# EAGLE board Main Board (EAGLE 5.10)
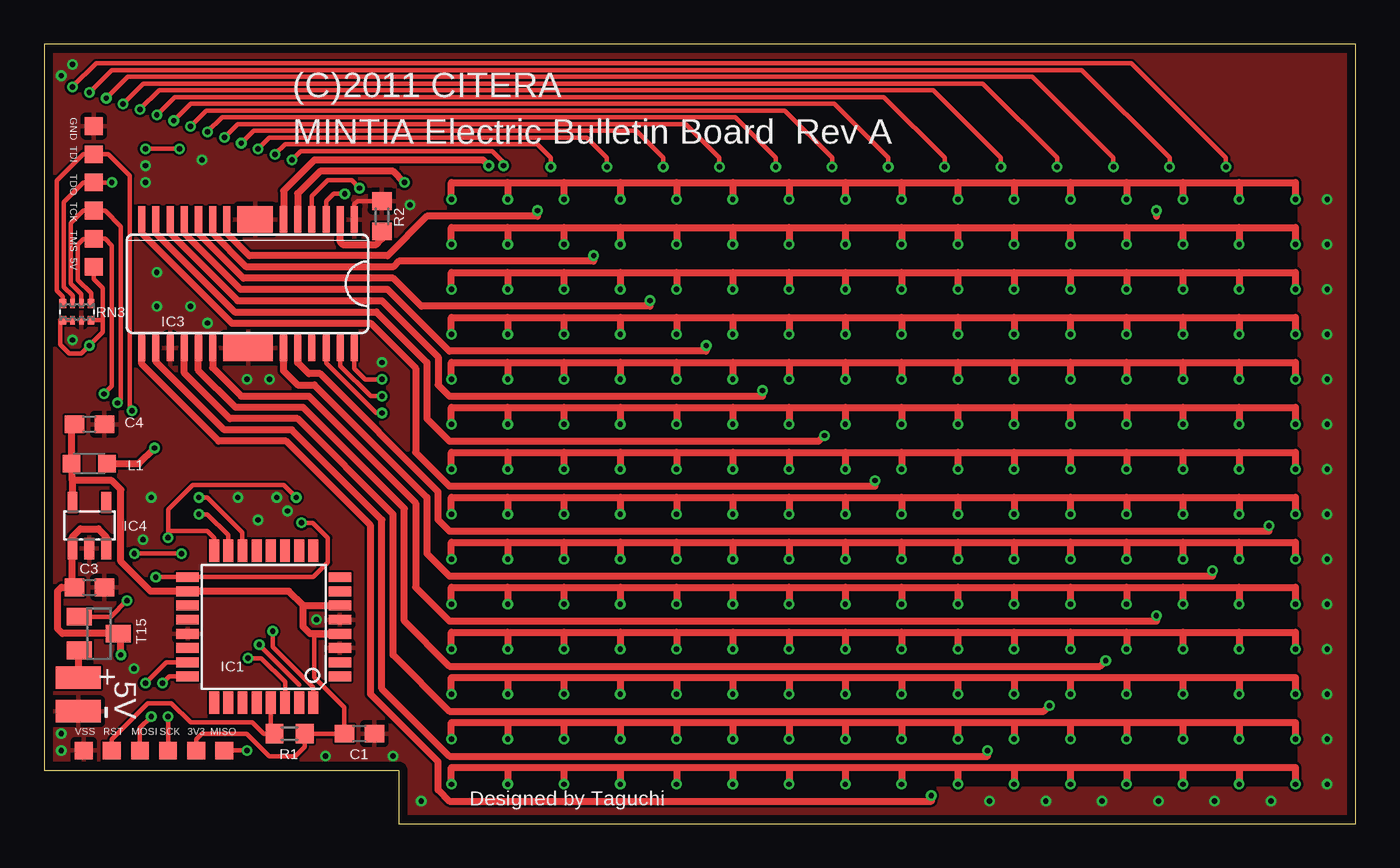
[diagram p1: board, top side]
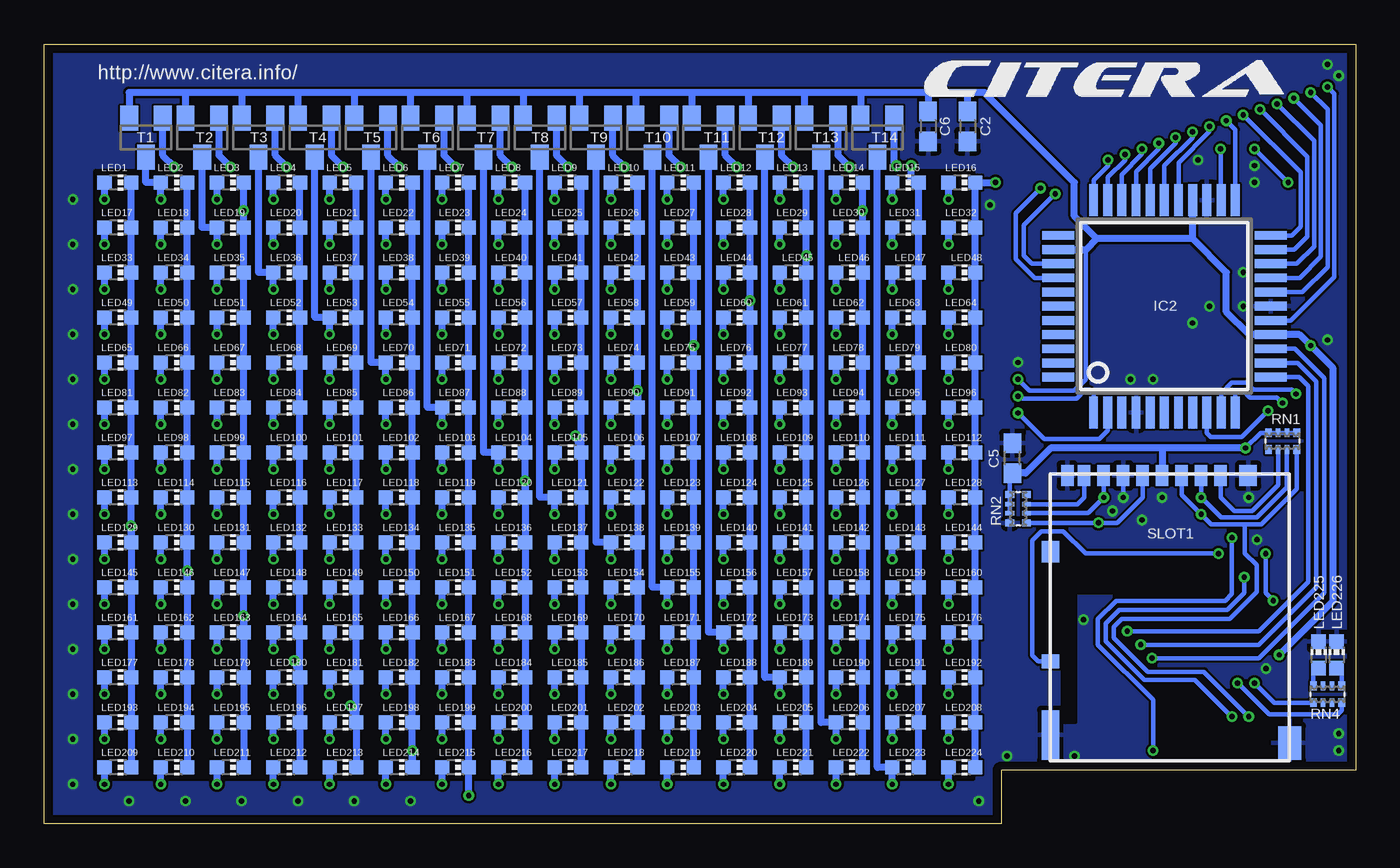
[diagram p2: board, bottom side, seen from below]

Size 74 x 44 mm. Coordinates in mm from the lower left corner, seen from the top.
Outline: 74,44 0,44 0,3 20,3 20,0 74,0 74,44
Copper layers (1+2*15+16): Top 0.018mm / dielectric 0.25mm / Route2 0.035mm / dielectric 1mm / Route15 0.035mm / dielectric 0.25mm / Bottom 0.018mm
Design rules "pban_5mil-l4": minimum track width 5mil, minimum drill 0.3mm, track to track 5mil, track to pad 0.229mm, pad to pad 5mil, via to via 5mil, smd to smd 5mil, copper to edge 0.5mm, drill to drill 0.5mm, minimum pad ring 0.15mm, minimum via ring 0.15mm, stop-mask expansion 4mil, vias tented up to drill 0.35mm, thermal gap 10mil
tRestrict: area 22.9,2.2 to 70.6,36.2
bRestrict: area 21.6,2.5 to 71.1,36.8

## Footprints (pad centres in the part's own frame; a part is rotated, then mirrored left to right if it is on the bottom)
TP10SQ = smd 1 x 1: TP 0,0
SMD1,27-2,54 = smd 1.27 x 2.54: 1 0,0
C0603 = smd 1.1 x 1: 1 -0.85,0; 2 0.85,0
TQFP32-08 = smd 1.27 x 0.559: 1 -4.293,2.8; 2 -4.293,2; 3 -4.293,1.2; 4 -4.293,0.4; 5 -4.293,-0.4; 6 -4.293,-1.2; 7 -4.293,-2; 8 -4.293,-2.8; 17 4.293,-2.8; 18 4.293,-2; 19 4.293,-1.2; 20 4.293,-0.4; 21 4.293,0.4; 22 4.293,1.2; 23 4.293,2; 24 4.293,2.8 | smd 0.559 x 1.27: 9 -2.8,-4.293; 10 -2,-4.293; 11 -1.2,-4.293; 12 -0.4,-4.293; 13 0.4,-4.293; 14 1.2,-4.293; 15 2,-4.293; 16 2.8,-4.293; 25 2.8,4.293; 26 2,4.293; 27 1.2,4.293; 28 0.4,4.293; 29 -0.4,4.293; 30 -1.2,4.293; 31 -2,4.293; 32 -2.8,4.293
SQFP-S-10X10-44 = smd 0.5 x 1.8: 1 -4,-6; 2 -3.2,-6; 3 -2.4,-6; 4 -1.6,-6; 5 -0.8,-6; 6 0,-6; 7 0.8,-6; 8 1.6,-6; 9 2.4,-6; 10 3.2,-6; 11 4,-6; 23 4,6; 24 3.2,6; 25 2.4,6; 26 1.6,6; 27 0.8,6; 28 0,6; 29 -0.8,6; 30 -1.6,6; 31 -2.4,6; 32 -3.2,6; 33 -4,6 | smd 1.8 x 0.5: 12 6,-4; 13 6,-3.2; 14 6,-2.4; 15 6,-1.6; 16 6,-0.8; 17 6,0; 18 6,0.8; 19 6,1.6; 20 6,2.4; 21 6,3.2; 22 6,4; 34 -6,4; 35 -6,3.2; 36 -6,2.4; 37 -6,1.6; 38 -6,0.8; 39 -6,0; 40 -6,-0.8; 41 -6,-1.6; 42 -6,-2.4; 43 -6,-3.2; 44 -6,-4
HSOP25 = smd 0.4 x 1.5: 1 -6.07,-3.625; 2 -5.27,-3.625; 3 -4.47,-3.625; 4 -3.67,-3.625; 5 -2.87,-3.625; 6 -2.07,-3.625; 7 1.13,-3.625; 8 1.93,-3.625; 9 2.73,-3.625; 10 3.53,-3.625; 11 4.33,-3.625; 12 5.13,-3.625; 13 5.93,-3.625; 14 5.93,3.625; 15 5.13,3.625; 16 4.33,3.625; 17 3.53,3.625; 18 2.73,3.625; 19 1.93,3.625; 20 -2.07,3.625; 21 -2.87,3.625; 22 -3.67,3.625; 23 -4.47,3.625; 24 -5.27,3.625; 25 -6.07,3.625 | smd 2 x 1.5: 26 -0.47,-3.625 | smd 2.8 x 1.5: 27 -0.072,3.628
SOT23-5L = smd 0.55 x 1.2: 1 -0.95,-1.3; 2 0,-1.3; 3 0.95,-1.3; 4 0.95,1.3; 5 -0.95,1.3
L2012C = smd 1 x 1: 1 -1,0; 2 1,0
CHIP-LED0603 = smd 0.8 x 0.8: A 0,-0.75; C 0,0.75
R0603 = smd 1 x 1.1: 1 -0.85,0; 2 0.85,0
EXBN8V = smd 0.38 x 0.5: 1 -0.8,-0.475; 4 0.8,-0.475; 5 0.8,0.475; 8 -0.8,0.475 | smd 0.25 x 0.5: 2 -0.25,-0.475; 3 0.25,-0.475; 6 0.25,0.475; 7 -0.25,0.475
DM3AT-SF-PEJ = smd 0.7 x 1.2: 1 0,0.6; 2 -1.1,0.6; 3 -2.2,0.6; 4 -3.3,0.6; 5 -4.4,0.6; 6 -5.5,0.6; 7 -6.6,0.6; 8 -7.7,0.6; 9 -8.65,0.6 | smd 1 x 1.2: 10 -9.6,-3.7; 14 1.55,0.6 | smd 1 x 0.8: 11 -9.6,-9.9 | smd 1 x 2.8: 12 -9.6,-14.05 | smd 1.3 x 1.9: 13 3.9,-14.5
SOT23 = smd 1 x 1.4: 1 -0.95,-1.1; 2 0.95,-1.1; 3 0,1.1

## Placement (x,y rotation side)
3V3  TPTP10SQ  [TP10SQ]  8.57,4.13 180 top
5V  TPTP10SQ  [TP10SQ]  2.79,31.43 180 top
+  [SMD1,27-2,54]  1.91,8.26 90 top
-  [SMD1,27-2,54]  1.91,6.35 90 top
C1  0.1uF  [C0603]  17.78,5.08 0 top
C2  0.1uF  [C0603]  21.91,39.37 270 bottom
C3  1uF  [C0603]  2.54,13.34 0 top
C4  1uF  [C0603]  2.54,22.54 0 top
C5  0.1uF  [C0603]  19.37,20.64 90 bottom
C6  0.1uF  [C0603]  24.13,39.37 270 bottom
GND  TPTP10SQ  [TP10SQ]  2.79,39.37 180 top
IC1  ATMEGA8,88,168,328-TQFP  [TQFP32-08]  12.38,11.11 180 top
IC2  XC9536_44VQ  [SQFP-S-10X10-44]  10.79,29.21 0 bottom
IC3  BD7851FP  [HSOP25]  11.43,30.48 180 top
IC4  PT7M8206B33TA5EX  [SOT23-5L]  2.54,16.83 0 top
L1  330uH  [L2012C]  2.54,20.32 180 top
LED1  RED  [CHIP-LED0603]  69.85,36.2 270 bottom
LED2  RED  [CHIP-LED0603]  66.67,36.2 270 bottom
LED3  RED  [CHIP-LED0603]  63.5,36.2 270 bottom
LED4  RED  [CHIP-LED0603]  60.33,36.2 270 bottom
LED5  RED  [CHIP-LED0603]  57.15,36.2 270 bottom
LED6  RED  [CHIP-LED0603]  53.98,36.2 270 bottom
LED7  RED  [CHIP-LED0603]  50.8,36.2 270 bottom
LED8  RED  [CHIP-LED0603]  47.62,36.2 270 bottom
LED9  RED  [CHIP-LED0603]  44.45,36.2 270 bottom
LED10  RED  [CHIP-LED0603]  41.27,36.2 270 bottom
LED11  RED  [CHIP-LED0603]  38.1,36.2 270 bottom
LED12  RED  [CHIP-LED0603]  34.92,36.2 270 bottom
LED13  RED  [CHIP-LED0603]  31.75,36.2 270 bottom
LED14  RED  [CHIP-LED0603]  28.57,36.2 270 bottom
LED15  RED  [CHIP-LED0603]  25.4,36.2 270 bottom
LED16  RED  [CHIP-LED0603]  22.23,36.2 270 bottom
LED17  RED  [CHIP-LED0603]  69.85,33.66 270 bottom
LED18  RED  [CHIP-LED0603]  66.67,33.66 270 bottom
LED19  RED  [CHIP-LED0603]  63.5,33.66 270 bottom
LED20  RED  [CHIP-LED0603]  60.33,33.66 270 bottom
LED21  RED  [CHIP-LED0603]  57.15,33.66 270 bottom
LED22  RED  [CHIP-LED0603]  53.98,33.66 270 bottom
LED23  RED  [CHIP-LED0603]  50.8,33.66 270 bottom
LED24  RED  [CHIP-LED0603]  47.62,33.66 270 bottom
LED25  RED  [CHIP-LED0603]  44.45,33.66 270 bottom
LED26  RED  [CHIP-LED0603]  41.27,33.66 270 bottom
LED27  RED  [CHIP-LED0603]  38.1,33.66 270 bottom
LED28  RED  [CHIP-LED0603]  34.92,33.66 270 bottom
LED29  RED  [CHIP-LED0603]  31.75,33.66 270 bottom
LED30  RED  [CHIP-LED0603]  28.57,33.66 270 bottom
LED31  RED  [CHIP-LED0603]  25.4,33.66 270 bottom
LED32  RED  [CHIP-LED0603]  22.23,33.66 270 bottom
LED33  RED  [CHIP-LED0603]  69.85,31.11 270 bottom
LED34  RED  [CHIP-LED0603]  66.67,31.11 270 bottom
LED35  RED  [CHIP-LED0603]  63.5,31.11 270 bottom
LED36  RED  [CHIP-LED0603]  60.33,31.11 270 bottom
LED37  RED  [CHIP-LED0603]  57.15,31.11 270 bottom
LED38  RED  [CHIP-LED0603]  53.98,31.11 270 bottom
LED39  RED  [CHIP-LED0603]  50.8,31.11 270 bottom
LED40  RED  [CHIP-LED0603]  47.62,31.11 270 bottom
LED41  RED  [CHIP-LED0603]  44.45,31.11 270 bottom
LED42  RED  [CHIP-LED0603]  41.27,31.11 270 bottom
LED43  RED  [CHIP-LED0603]  38.1,31.11 270 bottom
LED44  RED  [CHIP-LED0603]  34.92,31.11 270 bottom
LED45  RED  [CHIP-LED0603]  31.75,31.11 270 bottom
LED46  RED  [CHIP-LED0603]  28.57,31.11 270 bottom
LED47  RED  [CHIP-LED0603]  25.4,31.11 270 bottom
LED48  RED  [CHIP-LED0603]  22.23,31.11 270 bottom
LED49  RED  [CHIP-LED0603]  69.85,28.57 270 bottom
LED50  RED  [CHIP-LED0603]  66.67,28.57 270 bottom
LED51  RED  [CHIP-LED0603]  63.5,28.57 270 bottom
LED52  RED  [CHIP-LED0603]  60.33,28.57 270 bottom
LED53  RED  [CHIP-LED0603]  57.15,28.57 270 bottom
LED54  RED  [CHIP-LED0603]  53.98,28.57 270 bottom
LED55  RED  [CHIP-LED0603]  50.8,28.57 270 bottom
LED56  RED  [CHIP-LED0603]  47.62,28.57 270 bottom
LED57  RED  [CHIP-LED0603]  44.45,28.57 270 bottom
LED58  RED  [CHIP-LED0603]  41.27,28.57 270 bottom
LED59  RED  [CHIP-LED0603]  38.1,28.57 270 bottom
LED60  RED  [CHIP-LED0603]  34.92,28.57 270 bottom
LED61  RED  [CHIP-LED0603]  31.75,28.57 270 bottom
LED62  RED  [CHIP-LED0603]  28.57,28.57 270 bottom
LED63  RED  [CHIP-LED0603]  25.4,28.57 270 bottom
LED64  RED  [CHIP-LED0603]  22.23,28.57 270 bottom
LED65  RED  [CHIP-LED0603]  69.85,26.04 270 bottom
LED66  RED  [CHIP-LED0603]  66.67,26.04 270 bottom
LED67  RED  [CHIP-LED0603]  63.5,26.04 270 bottom
LED68  RED  [CHIP-LED0603]  60.33,26.04 270 bottom
LED69  RED  [CHIP-LED0603]  57.15,26.04 270 bottom
LED70  RED  [CHIP-LED0603]  53.98,26.04 270 bottom
LED71  RED  [CHIP-LED0603]  50.8,26.04 270 bottom
LED72  RED  [CHIP-LED0603]  47.62,26.04 270 bottom
LED73  RED  [CHIP-LED0603]  44.45,26.04 270 bottom
LED74  RED  [CHIP-LED0603]  41.27,26.04 270 bottom
LED75  RED  [CHIP-LED0603]  38.1,26.04 270 bottom
LED76  RED  [CHIP-LED0603]  34.92,26.04 270 bottom
LED77  RED  [CHIP-LED0603]  31.75,26.04 270 bottom
LED78  RED  [CHIP-LED0603]  28.57,26.04 270 bottom
LED79  RED  [CHIP-LED0603]  25.4,26.04 270 bottom
LED80  RED  [CHIP-LED0603]  22.23,26.04 270 bottom
LED81  RED  [CHIP-LED0603]  69.85,23.5 270 bottom
LED82  RED  [CHIP-LED0603]  66.67,23.5 270 bottom
LED83  RED  [CHIP-LED0603]  63.5,23.5 270 bottom
LED84  RED  [CHIP-LED0603]  60.33,23.5 270 bottom
LED85  RED  [CHIP-LED0603]  57.15,23.5 270 bottom
LED86  RED  [CHIP-LED0603]  53.98,23.5 270 bottom
LED87  RED  [CHIP-LED0603]  50.8,23.5 270 bottom
LED88  RED  [CHIP-LED0603]  47.62,23.5 270 bottom
LED89  RED  [CHIP-LED0603]  44.45,23.5 270 bottom
LED90  RED  [CHIP-LED0603]  41.27,23.5 270 bottom
LED91  RED  [CHIP-LED0603]  38.1,23.5 270 bottom
LED92  RED  [CHIP-LED0603]  34.92,23.5 270 bottom
LED93  RED  [CHIP-LED0603]  31.75,23.5 270 bottom
LED94  RED  [CHIP-LED0603]  28.57,23.5 270 bottom
LED95  RED  [CHIP-LED0603]  25.4,23.5 270 bottom
LED96  RED  [CHIP-LED0603]  22.23,23.5 270 bottom
LED97  RED  [CHIP-LED0603]  69.85,20.95 270 bottom
LED98  RED  [CHIP-LED0603]  66.67,20.95 270 bottom
LED99  RED  [CHIP-LED0603]  63.5,20.95 270 bottom
LED100  RED  [CHIP-LED0603]  60.33,20.95 270 bottom
LED101  RED  [CHIP-LED0603]  57.15,20.95 270 bottom
LED102  RED  [CHIP-LED0603]  53.98,20.95 270 bottom
LED103  RED  [CHIP-LED0603]  50.8,20.95 270 bottom
LED104  RED  [CHIP-LED0603]  47.62,20.95 270 bottom
LED105  RED  [CHIP-LED0603]  44.45,20.95 270 bottom
LED106  RED  [CHIP-LED0603]  41.27,20.95 270 bottom
LED107  RED  [CHIP-LED0603]  38.1,20.95 270 bottom
LED108  RED  [CHIP-LED0603]  34.92,20.95 270 bottom
LED109  RED  [CHIP-LED0603]  31.75,20.95 270 bottom
LED110  RED  [CHIP-LED0603]  28.57,20.95 270 bottom
LED111  RED  [CHIP-LED0603]  25.4,20.95 270 bottom
LED112  RED  [CHIP-LED0603]  22.23,20.95 270 bottom
LED113  RED  [CHIP-LED0603]  69.85,18.41 270 bottom
LED114  RED  [CHIP-LED0603]  66.67,18.41 270 bottom
LED115  RED  [CHIP-LED0603]  63.5,18.41 270 bottom
LED116  RED  [CHIP-LED0603]  60.33,18.41 270 bottom
LED117  RED  [CHIP-LED0603]  57.15,18.41 270 bottom
LED118  RED  [CHIP-LED0603]  53.98,18.41 270 bottom
LED119  RED  [CHIP-LED0603]  50.8,18.41 270 bottom
LED120  RED  [CHIP-LED0603]  47.62,18.41 270 bottom
LED121  RED  [CHIP-LED0603]  44.45,18.41 270 bottom
LED122  RED  [CHIP-LED0603]  41.27,18.41 270 bottom
LED123  RED  [CHIP-LED0603]  38.1,18.41 270 bottom
LED124  RED  [CHIP-LED0603]  34.92,18.41 270 bottom
LED125  RED  [CHIP-LED0603]  31.75,18.41 270 bottom
LED126  RED  [CHIP-LED0603]  28.57,18.41 270 bottom
LED127  RED  [CHIP-LED0603]  25.4,18.41 270 bottom
LED128  RED  [CHIP-LED0603]  22.23,18.41 270 bottom
LED129  RED  [CHIP-LED0603]  69.85,15.88 270 bottom
LED130  RED  [CHIP-LED0603]  66.67,15.88 270 bottom
LED131  RED  [CHIP-LED0603]  63.5,15.88 270 bottom
LED132  RED  [CHIP-LED0603]  60.33,15.88 270 bottom
LED133  RED  [CHIP-LED0603]  57.15,15.88 270 bottom
LED134  RED  [CHIP-LED0603]  53.98,15.88 270 bottom
LED135  RED  [CHIP-LED0603]  50.8,15.88 270 bottom
LED136  RED  [CHIP-LED0603]  47.62,15.88 270 bottom
LED137  RED  [CHIP-LED0603]  44.45,15.88 270 bottom
LED138  RED  [CHIP-LED0603]  41.27,15.88 270 bottom
LED139  RED  [CHIP-LED0603]  38.1,15.88 270 bottom
LED140  RED  [CHIP-LED0603]  34.92,15.88 270 bottom
LED141  RED  [CHIP-LED0603]  31.75,15.88 270 bottom
LED142  RED  [CHIP-LED0603]  28.57,15.88 270 bottom
LED143  RED  [CHIP-LED0603]  25.4,15.88 270 bottom
LED144  RED  [CHIP-LED0603]  22.23,15.88 270 bottom
LED145  RED  [CHIP-LED0603]  69.85,13.34 270 bottom
LED146  RED  [CHIP-LED0603]  66.67,13.34 270 bottom
LED147  RED  [CHIP-LED0603]  63.5,13.34 270 bottom
LED148  RED  [CHIP-LED0603]  60.33,13.34 270 bottom
LED149  RED  [CHIP-LED0603]  57.15,13.34 270 bottom
LED150  RED  [CHIP-LED0603]  53.98,13.34 270 bottom
LED151  RED  [CHIP-LED0603]  50.8,13.34 270 bottom
LED152  RED  [CHIP-LED0603]  47.62,13.34 270 bottom
LED153  RED  [CHIP-LED0603]  44.45,13.34 270 bottom
LED154  RED  [CHIP-LED0603]  41.27,13.34 270 bottom
LED155  RED  [CHIP-LED0603]  38.1,13.34 270 bottom
LED156  RED  [CHIP-LED0603]  34.92,13.34 270 bottom
LED157  RED  [CHIP-LED0603]  31.75,13.34 270 bottom
LED158  RED  [CHIP-LED0603]  28.57,13.34 270 bottom
LED159  RED  [CHIP-LED0603]  25.4,13.34 270 bottom
LED160  RED  [CHIP-LED0603]  22.23,13.34 270 bottom
LED161  RED  [CHIP-LED0603]  69.85,10.79 270 bottom
LED162  RED  [CHIP-LED0603]  66.67,10.79 270 bottom
LED163  RED  [CHIP-LED0603]  63.5,10.79 270 bottom
LED164  RED  [CHIP-LED0603]  60.33,10.79 270 bottom
LED165  RED  [CHIP-LED0603]  57.15,10.79 270 bottom
LED166  RED  [CHIP-LED0603]  53.98,10.79 270 bottom
LED167  RED  [CHIP-LED0603]  50.8,10.79 270 bottom
LED168  RED  [CHIP-LED0603]  47.62,10.79 270 bottom
LED169  RED  [CHIP-LED0603]  44.45,10.79 270 bottom
LED170  RED  [CHIP-LED0603]  41.27,10.79 270 bottom
LED171  RED  [CHIP-LED0603]  38.1,10.79 270 bottom
LED172  RED  [CHIP-LED0603]  34.92,10.79 270 bottom
LED173  RED  [CHIP-LED0603]  31.75,10.79 270 bottom
LED174  RED  [CHIP-LED0603]  28.57,10.79 270 bottom
LED175  RED  [CHIP-LED0603]  25.4,10.79 270 bottom
LED176  RED  [CHIP-LED0603]  22.23,10.79 270 bottom
LED177  RED  [CHIP-LED0603]  69.85,8.26 270 bottom
LED178  RED  [CHIP-LED0603]  66.67,8.26 270 bottom
LED179  RED  [CHIP-LED0603]  63.5,8.26 270 bottom
LED180  RED  [CHIP-LED0603]  60.33,8.26 270 bottom
LED181  RED  [CHIP-LED0603]  57.15,8.26 270 bottom
LED182  RED  [CHIP-LED0603]  53.98,8.26 270 bottom
LED183  RED  [CHIP-LED0603]  50.8,8.26 270 bottom
LED184  RED  [CHIP-LED0603]  47.62,8.26 270 bottom
LED185  RED  [CHIP-LED0603]  44.45,8.26 270 bottom
LED186  RED  [CHIP-LED0603]  41.27,8.26 270 bottom
LED187  RED  [CHIP-LED0603]  38.1,8.26 270 bottom
LED188  RED  [CHIP-LED0603]  34.92,8.26 270 bottom
LED189  RED  [CHIP-LED0603]  31.75,8.26 270 bottom
LED190  RED  [CHIP-LED0603]  28.57,8.26 270 bottom
LED191  RED  [CHIP-LED0603]  25.4,8.26 270 bottom
LED192  RED  [CHIP-LED0603]  22.23,8.26 270 bottom
LED193  RED  [CHIP-LED0603]  69.85,5.71 270 bottom
LED194  RED  [CHIP-LED0603]  66.67,5.71 270 bottom
LED195  RED  [CHIP-LED0603]  63.5,5.71 270 bottom
LED196  RED  [CHIP-LED0603]  60.33,5.71 270 bottom
LED197  RED  [CHIP-LED0603]  57.15,5.71 270 bottom
LED198  RED  [CHIP-LED0603]  53.98,5.71 270 bottom
LED199  RED  [CHIP-LED0603]  50.8,5.71 270 bottom
LED200  RED  [CHIP-LED0603]  47.62,5.71 270 bottom
LED201  RED  [CHIP-LED0603]  44.45,5.71 270 bottom
LED202  RED  [CHIP-LED0603]  41.27,5.71 270 bottom
LED203  RED  [CHIP-LED0603]  38.1,5.71 270 bottom
LED204  RED  [CHIP-LED0603]  34.92,5.71 270 bottom
LED205  RED  [CHIP-LED0603]  31.75,5.71 270 bottom
LED206  RED  [CHIP-LED0603]  28.57,5.71 270 bottom
LED207  RED  [CHIP-LED0603]  25.4,5.71 270 bottom
LED208  RED  [CHIP-LED0603]  22.23,5.71 270 bottom
LED209  RED  [CHIP-LED0603]  69.85,3.17 270 bottom
LED210  RED  [CHIP-LED0603]  66.67,3.17 270 bottom
LED211  RED  [CHIP-LED0603]  63.5,3.17 270 bottom
LED212  RED  [CHIP-LED0603]  60.33,3.17 270 bottom
LED213  RED  [CHIP-LED0603]  57.15,3.17 270 bottom
LED214  RED  [CHIP-LED0603]  53.98,3.17 270 bottom
LED215  RED  [CHIP-LED0603]  50.8,3.17 270 bottom
LED216  RED  [CHIP-LED0603]  47.62,3.17 270 bottom
LED217  RED  [CHIP-LED0603]  44.45,3.17 270 bottom
LED218  RED  [CHIP-LED0603]  41.27,3.17 270 bottom
LED219  RED  [CHIP-LED0603]  38.1,3.17 270 bottom
LED220  RED  [CHIP-LED0603]  34.92,3.17 270 bottom
LED221  RED  [CHIP-LED0603]  31.75,3.17 270 bottom
LED222  RED  [CHIP-LED0603]  28.57,3.17 270 bottom
LED223  RED  [CHIP-LED0603]  25.4,3.17 270 bottom
LED224  RED  [CHIP-LED0603]  22.23,3.17 270 bottom
LED225  RED  [CHIP-LED0603]  2.1,9.53 0 bottom
LED226  GREEN  [CHIP-LED0603]  1.08,9.53 0 bottom
MISO  TPTP10SQ  [TP10SQ]  10.16,4.13 180 top
MOSI  TPTP10SQ  [TP10SQ]  5.4,4.13 180 top
R1  10k  [R0603]  13.84,5.08 180 top
R2  2k  [R0603]  19.05,34.29 270 top
RN1  47k  [EXBN8V]  4.13,21.59 0 bottom
RN2  47k  [EXBN8V]  19.05,17.78 90 bottom
RN3  10k  [EXBN8V]  1.84,28.89 180 top
RN4  1k  [EXBN8V]  1.59,7.3 180 bottom
RST  TPTP10SQ  [TP10SQ]  3.81,4.13 180 top
SCK  TPTP10SQ  [TP10SQ]  6.99,4.13 180 top
SLOT1  DM3AT-SF-PEJ  [DM3AT-SF-PEJ]  7.62,19.05 0 bottom
T1  IRLML6402  [SOT23]  68.26,38.73 180 bottom
T2  IRLML6402  [SOT23]  65.09,38.73 180 bottom
T3  IRLML6402  [SOT23]  61.91,38.73 180 bottom
T4  IRLML6402  [SOT23]  58.74,38.73 180 bottom
T5  IRLML6402  [SOT23]  55.56,38.73 180 bottom
T6  IRLML6402  [SOT23]  52.39,38.73 180 bottom
T7  IRLML6402  [SOT23]  49.21,38.73 180 bottom
T8  IRLML6402  [SOT23]  46.04,38.73 180 bottom
T9  IRLML6402  [SOT23]  42.86,38.73 180 bottom
T10  IRLML6402  [SOT23]  39.69,38.73 180 bottom
T11  IRLML6402  [SOT23]  36.51,38.73 180 bottom
T12  IRLML6402  [SOT23]  33.34,38.73 180 bottom
T13  IRLML6402  [SOT23]  30.16,38.73 180 bottom
T14  IRLML6402  [SOT23]  26.99,38.73 180 bottom
T15  IRLML6402  [SOT23]  3.08,10.73 270 top
TCK  TPTP10SQ  [TP10SQ]  2.79,34.61 180 top
TDI  TPTP10SQ  [TP10SQ]  2.79,37.78 180 top
TDO  TPTP10SQ  [TP10SQ]  2.79,36.2 180 top
TMS  TPTP10SQ  [TP10SQ]  2.79,33.02 180 top
U$1  [CITERA]  24.75,40.75 0 bottom
VSS  TPTP10SQ  [TP10SQ]  2.22,4.13 180 top

## Tracks (layer width: path | path; a pad name or v marks a point on that pad's centre or on a via)
+3V3
  Top 0.254: 3V3.TP 8.57,4.76 8.89,5.08 11.43,5.08 12.7,3.81 14.16,3.81 14.69,4.34 R1.1 C1.1 16.93,6.57 15.24,8.26 15.24,10.71
  Top 0.406: 1.59,19.37 IC4.5 | 14.61,12.31 14.61,11.11 15.01,10.71 IC1.4 15.24,10.71 | 14.61,12.31 IC1.6 | 14.61,12.31 13.8,13.11 IC1.18 6,13.11 4.32,14.79 4.32,18.86 3.81,19.37 1.59,19.37 | 1.59,19.37 1.59,20.32 L1.2 1.54,22.54 C4.1
+5V  (via drill 0.3)
  Top 0.254: IC3.25 17.5,25.68 18.1,25.08 v19.05,25.08 | 3.3,28.42 3.3,27.75 v2.54,26.99 2.1,26.54 1.4,26.54 0.89,27.05 0.89,28.42 RN3.5 RN3.6 | 5V.TP 2.79,30.73 3.3,30.23 3.3,28.42 | 3.3,28.42 RN3.8
  Top 0.406: IC4.3 3.49,16.2 3.05,16.64 2.03,16.64 1.59,16.2 IC4.1 1.59,13.34 | v4.32,9.53 4.32,10.73 T15.3 1.02,10.73 0.75,11 0.75,13.12 0.96,13.34 1.59,13.34 | 1.59,13.34 C3.1
  Bottom 0.254: v19.05,25.08 18.41,24.45 15.88,24.45 15.24,25.08 15.24,32.38
  Bottom 0.406: T1.2 69.21,41.27 66.04,41.27 | 66.04,41.27 T2.2 | 62.86,41.27 66.04,41.27 | 50.16,41.27 53.34,41.27 | 43.81,41.27 46.99,41.27 | 37.46,41.27 40.64,41.27 | 31.11,41.27 34.29,41.27 | 27.94,41.27 T14.2 | 31.11,41.27 T13.2 | 27.94,41.27 31.11,41.27 | 34.29,41.27 T12.2 | 37.46,41.27 T11.2 | 34.29,41.27 37.46,41.27 | 40.64,41.27 T10.2 | 43.81,41.27 T9.2 | 40.64,41.27 43.81,41.27 | 46.99,41.27 T8.2 | 50.16,41.27 T7.2 | 46.99,41.27 50.16,41.27 | 53.34,41.27 T6.2 | 53.34,41.27 56.51,41.27 | 56.51,41.27 T5.2 | 56.51,41.27 59.69,41.27 | 59.69,41.27 T4.2 | 62.86,41.27 T3.2 | 59.69,41.27 62.86,41.27 | 9.2,33.02 IC2.26 | 21.91,41.27 24.13,41.27 | 24.13,41.27 27.94,41.27 | 14.61,33.02 15.88,34.29 15.88,36.2 20.95,41.27 21.91,41.27 | 9.2,33.02 7.3,31.11 7.3,28.89 6.02,27.61 IC2.15 3.16,27.61 v2.54,26.99 1.27,25.72 1.27,12.57 v4.32,9.53 | 9.2,33.02 14.61,33.02 | 14.61,33.02 15.24,32.38 16.77,32.38 IC2.35 | 24.13,41.27 C6.1 | 21.91,41.27 C2.1
COL_CLK  (via drill 0.3)
  Top 0.254: IC3.23 15.9,26.01 18.73,23.18 v19.05,23.18
  Bottom 0.254: IC2.2 13.99,22.2 14.48,21.71 17.59,21.71 v19.05,23.18
COL_EN  (via drill 0.3)
  Top 0.254: IC3.24 16.7,25.84 18.41,24.13 v19.05,24.13
  Bottom 0.254: IC2.1 14.79,24.3 15,24.5 15.25,24.5 15.75,24 18.92,24 v19.05,24.13
COL_LATCH  (via drill 0.3)
  Top 0.254: IC3.3 15.9,35.14 16.32,35.56 v16.95,35.56
  Bottom 0.254: IC2.36 18.27,31.61 18.73,32.07 18.73,33.78 v16.95,35.56
COL_SDATA  (via drill 0.3)
  Top 0.254: IC3.4 15.1,35.42 16,36.32 17.34,36.32 v17.78,35.88
  Bottom 0.254: IC2.37 18.11,30.81 19.18,31.88 19.18,34.48 v17.78,35.88
CTRL_BUS2  (via drill 0.3)
  Top 0.254: v12.13,10.1 14.38,7.84
  Bottom 0.254: IC2.13 3.28,26.01 2.22,24.96 2.22,13.34 5.46,10.1 v12.13,10.1
CTRL_MOSI  (via drill 0.3)
  Top 0.254: IC1.30 13.58,8.01 12.26,9.34 v11.49,9.34
  Bottom 0.254: IC2.14 3.44,26.81 1.78,25.15 1.78,13.02 5.46,9.34 v11.49,9.34
CTRL_SS  (via drill 0.3)
  Top 0.254: IC1.32 15.18,7.68 12.89,9.97 v12.89,10.86
  Bottom 0.254: IC2.12 3.17,25.21 2.67,24.7 2.67,13.65 5.46,10.86 v12.89,10.86
GND  (via drill 0.3)
  Top 0.254: R2.1 17.68,35.14 17.5,34.96 IC3.1
  Bottom 0.254: SLOT1.6 v13.12,18.41
  other vias: 20.64,34.92 11.43,25.08 12.7,25.08 8.89,37.47 21.27,1.27 19.05,26.04 6.03,18.41 15.37,11.51 10.92,18.41 6.35,31.11 6.35,29.21 8.26,29.21 9.21,28.26 5.71,37.15 12.06,17.14 1.59,42.86 72.39,35.24 72.39,32.7 72.39,30.16 72.39,27.62 72.39,25.08 72.39,22.54 72.39,20 72.39,17.46 72.39,14.92 72.39,12.38 72.39,9.84 72.39,7.3 72.39,4.76 72.39,2.22 5.71,36.2 0.95,42.23 1.59,27.3 15.88,3.81 19.68,3.81 53.34,1.27 56.52,1.27 59.69,1.27 62.87,1.27 66.04,1.27 69.22,1.27 0.95,4.13 0.95,5.08 5.07,8.74 13.72,17.65 5.57,16.02
  pour Top (isolate 0.13): 0.5,43.5 73.5,43.5 73.5,0.5 20.5,0.5 20.5,3.5 0.5,3.5
  pour Bottom (isolate 0.13): 0.5,43.5 0.5,3.5 20.5,3.5 20.5,0.5 73.5,0.5 73.5,43.5
N$1  (via drill 0.3)
  Top 0.406: LED127.A LED128.A v22.98,17.46 | LED127.A LED126.A | LED127.A v26.15,17.46 | v70.6,17.46 LED113.A LED114.A | LED114.A v67.42,17.46 | LED115.A LED114.A | LED115.A v64.25,17.46 | LED116.A LED115.A | LED116.A v61.08,17.46 | LED117.A LED116.A | LED117.A v57.9,17.46 | LED118.A LED117.A | LED118.A v54.73,17.46 | LED119.A LED118.A | LED119.A v51.55,17.46 | LED120.A LED119.A | LED120.A v48.38,17.46 | LED121.A LED120.A | LED121.A v45.2,17.46 | LED122.A LED121.A | LED122.A v42.02,17.46 | LED123.A LED122.A | LED123.A v38.85,17.46 | LED124.A LED123.A | LED124.A v35.67,17.46 | LED125.A LED124.A | LED125.A v32.5,17.46 | LED126.A LED125.A | LED126.A v29.32,17.46
  Bottom 0.406: v67.42,17.46 LED114.A | v64.25,17.46 LED115.A | v61.08,17.46 LED116.A | v57.9,17.46 LED117.A | v54.73,17.46 LED118.A | v51.55,17.46 LED119.A | v48.38,17.46 LED120.A | v45.2,17.46 LED121.A 46.04,18.41 T8.3 | v42.02,17.46 LED122.A | v38.85,17.46 LED123.A | v35.67,17.46 LED124.A | v32.5,17.46 LED125.A | v29.32,17.46 LED126.A | v26.15,17.46 LED127.A | v22.98,17.46 LED128.A | v70.6,17.46 LED113.A
N$2  (via drill 0.3)
  Top 0.406: v50.05,1.59 50.05,1.27 22.86,1.27 22.23,1.91 22.23,3.49 18.41,7.3 18.41,16.83 13.65,21.59 9.84,21.59 5.5,25.93 IC3.14
  Bottom 0.406: LED7.C LED23.C LED39.C LED55.C LED71.C LED87.C LED103.C LED119.C LED135.C LED151.C LED167.C LED183.C LED199.C LED215.C v50.05,1.59
N$3  (via drill 0.3)
  Top 0.406: v46.88,19.37 46.88,19.05 22.86,19.05 20.95,20.95 20.95,25.72 18.41,28.26 10.58,28.26 5.5,33.34 IC3.13
  Bottom 0.406: LED216.C LED200.C LED184.C LED168.C LED152.C LED136.C LED120.C | LED120.C LED104.C LED88.C LED72.C LED56.C LED40.C LED24.C LED8.C | v46.88,19.37 LED120.C
N$4  (via drill 0.3)
  Top 0.406: v44.02,21.91 43.7,21.59 22.86,21.59 21.59,22.86 21.59,26.04 18.73,28.89 10.74,28.89 6.3,33.34 IC3.12
  Bottom 0.406: LED105.C LED121.C LED137.C LED153.C LED169.C LED185.C LED201.C LED217.C 43.7,4.13 | LED105.C LED89.C LED73.C LED57.C LED41.C LED25.C LED9.C | v44.02,21.91 LED105.C
N$5  (via drill 0.3)
  Top 0.406: v70.6,32.7 LED17.A LED18.A | LED18.A v67.42,32.7 | LED19.A LED18.A | LED19.A v64.25,32.7 | LED20.A LED19.A | LED20.A v61.08,32.7 | LED21.A LED20.A | LED21.A v57.9,32.7 | LED22.A LED21.A | LED22.A v54.73,32.7 | LED23.A LED22.A | LED23.A v51.55,32.7 | LED24.A LED23.A | LED24.A v48.38,32.7 | LED25.A LED24.A | LED25.A v45.2,32.7 | LED26.A LED25.A | LED26.A v42.02,32.7 | LED27.A LED26.A | LED27.A v38.85,32.7 | LED28.A LED27.A | LED28.A v35.67,32.7 | LED29.A LED28.A | LED29.A v32.5,32.7 | LED30.A LED29.A | LED30.A v29.32,32.7 | LED31.A LED30.A | LED31.A v26.15,32.7 | LED31.A LED32.A v22.98,32.7
  Bottom 0.406: v70.6,32.7 LED17.A | v67.42,32.7 LED18.A | v64.25,32.7 LED19.A 65.09,33.66 T2.3 | v61.08,32.7 LED20.A | v57.9,32.7 LED21.A | v54.73,32.7 LED22.A | v51.55,32.7 LED23.A | v48.38,32.7 LED24.A | v45.2,32.7 LED25.A | v42.02,32.7 LED26.A | v38.85,32.7 LED27.A | v35.67,32.7 LED28.A | v32.5,32.7 LED29.A | v29.32,32.7 LED30.A | v26.15,32.7 LED31.A | v22.98,32.7 LED32.A
N$6  (via drill 0.3)
  Top 0.406: LED47.A LED48.A v22.98,30.16 | LED47.A LED46.A | LED47.A v26.15,30.16 | v70.6,30.16 LED33.A LED34.A | LED34.A v67.42,30.16 | LED35.A LED34.A | LED35.A v64.25,30.16 | LED36.A LED35.A | LED36.A v61.08,30.16 | LED37.A LED36.A | LED37.A v57.9,30.16 | LED38.A LED37.A | LED38.A v54.73,30.16 | LED39.A LED38.A | LED39.A v51.55,30.16 | LED40.A LED39.A | LED40.A v48.38,30.16 | LED41.A LED40.A | LED41.A v45.2,30.16 | LED42.A LED41.A | LED42.A v42.02,30.16 | LED43.A LED42.A | LED43.A v38.85,30.16 | LED44.A LED43.A | LED44.A v35.67,30.16 | LED45.A LED44.A | LED45.A v32.5,30.16 | LED46.A LED45.A | LED46.A v29.32,30.16
  Bottom 0.406: v70.6,30.16 LED33.A | v67.42,30.16 LED34.A | v64.25,30.16 LED35.A | v61.08,30.16 LED36.A 61.91,31.11 T3.3 | v57.9,30.16 LED37.A | v54.73,30.16 LED38.A | v51.55,30.16 LED39.A | v48.38,30.16 LED40.A | v45.2,30.16 LED41.A | v42.02,30.16 LED42.A | v38.85,30.16 LED43.A | v35.67,30.16 LED44.A | v32.5,30.16 LED45.A | v29.32,30.16 LED46.A | v26.15,30.16 LED47.A | v22.98,30.16 LED48.A
N$7  (via drill 0.3)
  Top 0.406: v70.6,27.62 LED49.A LED50.A | LED50.A v67.42,27.62 | LED51.A LED50.A | LED51.A v64.25,27.62 | LED52.A LED51.A | LED52.A v61.08,27.62 | LED53.A LED52.A | LED53.A v57.9,27.62 | LED54.A LED53.A | LED54.A v54.73,27.62 | LED55.A LED54.A | LED55.A v51.55,27.62 | LED56.A LED55.A | LED56.A v48.38,27.62 | LED57.A LED56.A | LED57.A v45.2,27.62 | LED58.A LED57.A | LED58.A v42.02,27.62 | LED59.A LED58.A | LED59.A v38.85,27.62 | LED60.A LED59.A | LED60.A v35.67,27.62 | LED61.A LED60.A | LED61.A v32.5,27.62 | LED62.A LED61.A | LED62.A v29.32,27.62 | LED63.A LED62.A | LED63.A v26.15,27.62 | LED63.A LED64.A v22.98,27.62
  Bottom 0.406: v70.6,27.62 LED49.A | v67.42,27.62 LED50.A | v64.25,27.62 LED51.A | v61.08,27.62 LED52.A | v57.9,27.62 LED53.A 58.74,28.57 T4.3 | v54.73,27.62 LED54.A | v51.55,27.62 LED55.A | v48.38,27.62 LED56.A | v45.2,27.62 LED57.A | v42.02,27.62 LED58.A | v38.85,27.62 LED59.A | v35.67,27.62 LED60.A | v32.5,27.62 LED61.A | v29.32,27.62 LED62.A | v26.15,27.62 LED63.A | v22.98,27.62 LED64.A
N$8  (via drill 0.3)
  Top 0.406: v70.6,25.08 LED65.A LED66.A | LED66.A v67.42,25.08 | LED67.A LED66.A | LED67.A v64.25,25.08 | LED68.A LED67.A | LED68.A v61.08,25.08 | LED69.A LED68.A | LED69.A v57.9,25.08 | LED70.A LED69.A | LED70.A v54.73,25.08 | LED71.A LED70.A | LED71.A v51.55,25.08 | LED72.A LED71.A | LED72.A v48.38,25.08 | LED73.A LED72.A | LED73.A v45.2,25.08 | LED74.A LED73.A | LED74.A v42.02,25.08 | LED75.A LED74.A | LED75.A v38.85,25.08 | LED76.A LED75.A | LED76.A v35.67,25.08 | LED77.A LED76.A | LED77.A v32.5,25.08 | LED78.A LED77.A | LED78.A v29.32,25.08 | LED79.A LED78.A | LED79.A v26.15,25.08 | LED79.A LED80.A v22.98,25.08
  Bottom 0.406: v70.6,25.08 LED65.A | v67.42,25.08 LED66.A | v64.25,25.08 LED67.A | v61.08,25.08 LED68.A | v57.9,25.08 LED69.A | v54.73,25.08 LED70.A 55.56,26.04 T5.3 | v51.55,25.08 LED71.A | v48.38,25.08 LED72.A | v45.2,25.08 LED73.A | v42.02,25.08 LED74.A | v38.85,25.08 LED75.A | v35.67,25.08 LED76.A | v32.5,25.08 LED77.A | v29.32,25.08 LED78.A | v26.15,25.08 LED79.A | v22.98,25.08 LED80.A
N$9  (via drill 0.3)
  Top 0.406: v70.6,22.54 LED81.A LED82.A | LED82.A v67.42,22.54 | LED83.A LED82.A | LED83.A v64.25,22.54 | LED84.A LED83.A | LED84.A v61.08,22.54 | LED85.A LED84.A | LED85.A v57.9,22.54 | LED86.A LED85.A | LED86.A v54.73,22.54 | LED87.A LED86.A | LED87.A v51.55,22.54 | LED88.A LED87.A | LED88.A v48.38,22.54 | LED89.A LED88.A | LED89.A v45.2,22.54 | LED90.A LED89.A | LED90.A v42.02,22.54 | LED91.A LED90.A | LED91.A v38.85,22.54 | LED92.A LED91.A | LED92.A v35.67,22.54 | LED93.A LED92.A | LED93.A v32.5,22.54 | LED94.A LED93.A | LED94.A v29.32,22.54 | LED95.A LED94.A | LED95.A v26.15,22.54 | LED95.A LED96.A v22.98,22.54
  Bottom 0.406: v70.6,22.54 LED81.A | v67.42,22.54 LED82.A | v64.25,22.54 LED83.A | v61.08,22.54 LED84.A | v57.9,22.54 LED85.A | v54.73,22.54 LED86.A | v51.55,22.54 LED87.A 52.39,23.5 T6.3 | v48.38,22.54 LED88.A | v45.2,22.54 LED89.A | v42.02,22.54 LED90.A | v38.85,22.54 LED91.A | v35.67,22.54 LED92.A | v32.5,22.54 LED93.A | v29.32,22.54 LED94.A | v26.15,22.54 LED95.A | v22.98,22.54 LED96.A
N$10  (via drill 0.3)
  Top 0.406: v70.6,7.3 LED177.A LED178.A | LED178.A v67.42,7.3 | LED179.A LED178.A | LED179.A v64.25,7.3 | LED180.A LED179.A | LED180.A v61.08,7.3 | LED181.A LED180.A | LED181.A v57.9,7.3 | LED182.A LED181.A | LED182.A v54.73,7.3 | LED183.A LED182.A | LED183.A v51.55,7.3 | LED184.A LED183.A | LED184.A v48.38,7.3 | LED185.A LED184.A | LED185.A v45.2,7.3 | LED186.A LED185.A | LED186.A v42.02,7.3 | LED187.A LED186.A | LED187.A v38.85,7.3 | LED188.A LED187.A | LED188.A v35.67,7.3 | LED189.A LED188.A | LED189.A v32.5,7.3 | LED190.A LED189.A | LED190.A v29.32,7.3 | LED191.A LED190.A | LED191.A v26.15,7.3 | LED191.A LED192.A v22.98,7.3
  Bottom 0.406: v70.6,7.3 LED177.A | v67.42,7.3 LED178.A | v64.25,7.3 LED179.A | v61.08,7.3 LED180.A | v57.9,7.3 LED181.A | v54.73,7.3 LED182.A | v51.55,7.3 LED183.A | v48.38,7.3 LED184.A | v45.2,7.3 LED185.A | v42.02,7.3 LED186.A | v38.85,7.3 LED187.A | v35.67,7.3 LED188.A | v32.5,7.3 LED189.A 33.34,8.26 T12.3 | v29.32,7.3 LED190.A | v26.15,7.3 LED191.A | v22.98,7.3 LED192.A
N$11  (via drill 0.3)
  Top 0.406: v40.52,24.45 40.52,24.13 22.86,24.13 22.23,24.77 22.23,26.35 19.05,29.53 10.91,29.53 7.1,33.34 IC3.11
  Bottom 0.406: LED202.C LED218.C | LED202.C LED186.C LED170.C LED154.C LED138.C LED122.C LED106.C LED90.C | LED90.C LED74.C LED58.C LED42.C LED26.C LED10.C | LED202.C 40.52,6.67 | v40.52,24.45 LED90.C
N$12  (via drill 0.3)
  Top 0.406: v70.6,14.92 LED129.A LED130.A | LED130.A v67.42,14.92 | LED131.A LED130.A | LED131.A v64.25,14.92 | LED132.A LED131.A | LED132.A v61.08,14.92 | LED133.A LED132.A | LED133.A v57.9,14.92 | LED134.A LED133.A | LED134.A v54.73,14.92 | LED135.A LED134.A | LED135.A v51.55,14.92 | LED136.A LED135.A | LED137.A LED136.A | LED137.A v45.2,14.92 | LED138.A LED137.A | LED138.A v42.02,14.92 | LED139.A LED138.A | LED139.A v38.85,14.92 | LED140.A LED139.A | LED140.A v35.67,14.92 | LED141.A LED140.A | LED141.A v32.5,14.92 | LED142.A LED141.A | LED142.A v29.32,14.92 | LED143.A LED142.A | LED143.A v26.15,14.92 | LED143.A LED144.A v22.98,14.92 | LED136.A v48.38,14.92
  Bottom 0.406: v70.6,14.92 LED129.A | v67.42,14.92 LED130.A | v64.25,14.92 LED131.A | v61.08,14.92 LED132.A | v57.9,14.92 LED133.A | v54.73,14.92 LED134.A | v51.55,14.92 LED135.A | v48.38,14.92 LED136.A | v45.2,14.92 LED137.A | v42.02,14.92 LED138.A 42.86,15.88 T9.3 | v38.85,14.92 LED139.A | v35.67,14.92 LED140.A | v32.5,14.92 LED141.A | v29.32,14.92 LED142.A | v26.15,14.92 LED143.A | v22.98,14.92 LED144.A
N$13  (via drill 0.3)
  Top 0.406: v70.6,12.38 LED145.A LED146.A | LED146.A v67.42,12.38 | LED147.A LED146.A | LED147.A v64.25,12.38 | LED148.A LED147.A | LED148.A v61.08,12.38 | LED149.A LED148.A | LED149.A v57.9,12.38 | LED150.A LED149.A | LED150.A v54.73,12.38 | LED151.A LED150.A | LED151.A v51.55,12.38 | LED152.A LED151.A | LED152.A v48.38,12.38 | LED153.A LED152.A | LED153.A v45.2,12.38 | LED154.A LED153.A | LED154.A v42.02,12.38 | LED155.A LED154.A | LED155.A v38.85,12.38 | LED156.A LED155.A | LED156.A v35.67,12.38 | LED157.A LED156.A | LED157.A v32.5,12.38 | LED158.A LED157.A | LED158.A v29.32,12.38 | LED159.A LED158.A | LED159.A v26.15,12.38 | LED159.A LED160.A v22.98,12.38
  Bottom 0.406: v70.6,12.38 LED145.A | v67.42,12.38 LED146.A | v64.25,12.38 LED147.A | v61.08,12.38 LED148.A | v57.9,12.38 LED149.A | v54.73,12.38 LED150.A | v51.55,12.38 LED151.A | v48.38,12.38 LED152.A | v45.2,12.38 LED153.A | v42.02,12.38 LED154.A | v38.85,12.38 LED155.A 39.69,13.34 T10.3 | v35.67,12.38 LED156.A | v32.5,12.38 LED157.A | v29.32,12.38 LED158.A | v26.15,12.38 LED159.A | v22.98,12.38 LED160.A
N$14  (via drill 0.3)
  Top 0.406: v70.6,9.84 LED161.A LED162.A | LED162.A v67.42,9.84 | LED163.A LED162.A | LED163.A v64.25,9.84 | LED164.A LED163.A | LED164.A v61.08,9.84 | LED165.A LED164.A | LED165.A v57.9,9.84 | LED166.A LED165.A | LED166.A v54.73,9.84 | LED167.A LED166.A | LED167.A v51.55,9.84 | LED168.A LED167.A | LED168.A v48.38,9.84 | LED169.A LED168.A | LED169.A v45.2,9.84 | LED170.A LED169.A | LED170.A v42.02,9.84 | LED171.A LED170.A | LED171.A v38.85,9.84 | LED172.A LED171.A | LED172.A v35.67,9.84 | LED173.A LED172.A | LED173.A v32.5,9.84 | LED174.A LED173.A | LED174.A v29.32,9.84 | LED175.A LED174.A | LED175.A v26.15,9.84 | LED175.A LED176.A v22.98,9.84
  Bottom 0.406: v70.6,9.84 LED161.A | v67.42,9.84 LED162.A | v64.25,9.84 LED163.A | v61.08,9.84 LED164.A | v57.9,9.84 LED165.A | v54.73,9.84 LED166.A | v51.55,9.84 LED167.A | v48.38,9.84 LED168.A | v45.2,9.84 LED169.A | v42.02,9.84 LED170.A | v38.85,9.84 LED171.A | v35.67,9.84 LED172.A 36.51,10.79 T11.3 | v32.5,9.84 LED173.A | v29.32,9.84 LED174.A | v26.15,9.84 LED175.A | v22.98,9.84 LED176.A
N$15  (via drill 0.3)
  Top 0.406: v37.35,26.99 37.35,26.67 22.86,26.67 19.37,30.16 11.07,30.16 7.9,33.34 IC3.10
  Bottom 0.406: LED219.C LED203.C LED187.C | LED187.C LED171.C LED155.C LED139.C LED123.C LED107.C LED91.C LED75.C | LED75.C LED59.C LED43.C LED27.C LED11.C | LED187.C 37.35,9.21 | LED75.C v37.35,26.99
N$16  (via drill 0.3)
  Top 0.406: v70.6,4.76 LED193.A LED194.A | LED194.A v67.42,4.76 | LED195.A LED194.A | LED195.A v64.25,4.76 | LED196.A LED195.A | LED196.A v61.08,4.76 | LED197.A LED196.A | LED197.A v57.9,4.76 | LED198.A LED197.A | LED198.A v54.73,4.76 | LED199.A LED198.A | LED199.A v51.55,4.76 | LED200.A LED199.A | LED200.A v48.38,4.76 | LED201.A LED200.A | LED201.A v45.2,4.76 | LED202.A LED201.A | LED202.A v42.02,4.76 | LED203.A LED202.A | LED203.A v38.85,4.76 | LED204.A LED203.A | LED204.A v35.67,4.76 | LED205.A LED204.A | LED205.A v32.5,4.76 | LED206.A LED205.A | LED206.A v29.32,4.76 | LED207.A LED206.A | LED207.A v26.15,4.76 | LED207.A LED208.A v22.98,4.76
  Bottom 0.406: v70.6,4.76 LED193.A | v67.42,4.76 LED194.A | v64.25,4.76 LED195.A | v61.08,4.76 LED196.A | v57.9,4.76 LED197.A | v54.73,4.76 LED198.A | v51.55,4.76 LED199.A | v45.2,4.76 LED201.A | v48.38,4.76 LED200.A | v42.02,4.76 LED202.A | v38.85,4.76 LED203.A | v35.67,4.76 LED204.A | v32.5,4.76 LED205.A | v29.32,4.76 LED206.A 30.16,5.71 T13.3 | v26.15,4.76 LED207.A | v22.98,4.76 LED208.A
N$17  (via drill 0.3)
  Top 0.406: v70.6,2.22 LED209.A LED210.A | LED210.A v67.42,2.22 | LED211.A LED210.A | LED211.A v64.25,2.22 | LED212.A LED211.A | LED212.A v61.08,2.22 | LED213.A LED212.A | LED213.A v57.9,2.22 | LED214.A LED213.A | LED214.A v54.73,2.22 | LED215.A LED214.A | LED215.A v51.55,2.22 | LED216.A LED215.A | LED216.A v48.38,2.22 | LED217.A LED216.A | LED217.A v45.2,2.22 | LED218.A LED217.A | LED218.A v42.02,2.22 | LED219.A LED218.A | LED219.A v38.85,2.22 | LED220.A LED219.A | LED220.A v35.67,2.22 | LED221.A LED220.A | LED221.A v32.5,2.22 | LED222.A LED221.A | LED222.A v29.32,2.22 | LED223.A LED222.A | LED223.A v26.15,2.22 | LED223.A LED224.A v22.98,2.22
  Bottom 0.406: v70.6,2.22 LED209.A | v67.42,2.22 LED210.A | v64.25,2.22 LED211.A | v61.08,2.22 LED212.A | v57.9,2.22 LED213.A | v54.73,2.22 LED214.A | v48.38,2.22 LED216.A | v51.55,2.22 LED215.A | v45.2,2.22 LED217.A | v42.02,2.22 LED218.A | v38.85,2.22 LED219.A | v35.67,2.22 LED220.A | v32.5,2.22 LED221.A | v29.32,2.22 LED222.A | v26.15,2.22 LED223.A 26.99,3.17 T14.3 | v22.98,2.22 LED224.A
N$18
  Bottom 0.254: LED226.A 0.79,8.78 RN4.1
N$19  (via drill 0.3)
  Top 0.406: v69.1,16.83 69.1,16.51 22.86,16.51 22.23,17.14 22.23,18.73 15.56,25.4 14.92,25.4 14.3,26.02 IC3.21
  Bottom 0.406: LED129.C LED113.C LED97.C LED81.C LED65.C LED49.C LED33.C LED17.C LED1.C | LED129.C LED145.C LED161.C LED177.C LED193.C LED209.C | v69.1,16.83 LED129.C
N$20  (via drill 0.3)
  Top 0.406: v65.92,14.29 65.92,13.97 22.86,13.97 21.59,15.24 21.59,18.41 15.24,24.77 14.29,24.77 13.5,25.55 IC3.20
  Bottom 0.406: LED2.C LED18.C LED34.C LED50.C LED66.C LED82.C LED98.C LED114.C LED130.C LED146.C | LED146.C LED162.C LED178.C LED194.C LED210.C | v65.92,14.29 LED146.C
N$21  (via drill 0.3)
  Top 0.406: v62.75,34.61 62.75,34.29 | v62.75,11.75 62.75,11.43 22.86,11.43 20.95,13.34 20.95,18.1 14.92,24.13 11.11,24.13 9.5,25.74 IC3.19
  Bottom 0.406: LED3.C v62.75,34.61 LED19.C LED35.C LED51.C LED67.C LED83.C LED99.C LED115.C LED131.C LED147.C LED163.C | LED163.C LED179.C LED195.C LED211.C | v62.75,11.75 LED163.C
N$22  (via drill 0.3)
  Top 0.406: v59.89,9.21 59.58,8.89 22.86,8.89 20.32,11.43 20.32,17.78 14.61,23.5 10.79,23.5 8.7,25.59 IC3.18
  Bottom 0.406: LED4.C LED20.C LED36.C LED52.C LED68.C LED84.C LED100.C LED116.C LED132.C LED148.C LED164.C LED180.C | LED180.C LED196.C LED212.C | v59.89,9.21 LED180.C
N$23  (via drill 0.3)
  Top 0.406: v56.72,6.67 56.4,6.35 22.86,6.35 19.68,9.53 19.68,17.46 14.29,22.86 10.48,22.86 7.9,25.44 IC3.17
  Bottom 0.406: LED5.C LED21.C LED37.C LED53.C LED69.C LED85.C LED101.C LED117.C LED133.C LED149.C LED165.C LED181.C LED197.C | LED197.C LED213.C | v56.72,6.67 LED197.C
N$24  (via drill 0.3)
  Top 0.406: v53.23,4.13 53.23,3.81 22.86,3.81 19.05,7.62 19.05,17.14 13.97,22.23 10.16,22.23 6.3,26.09 IC3.15
  Bottom 0.406: LED6.C LED22.C LED38.C LED54.C LED70.C LED86.C LED102.C LED118.C LED134.C LED150.C LED166.C LED182.C LED198.C LED214.C v53.23,4.13
N$25
  Bottom 0.254: LED225.A 2.39,8.48 RN4.4
N$26
  Top 0.406: T15.2 1.91,9.78 +.1
N$34
  Top 0.406: IC3.2 16.7,32.83 16.83,32.7 18.73,32.7 19.05,33.02 R2.2
N$35  (via drill 0.3)
  Top 0.406: v34.17,29.53 34.17,29.21 21.27,29.21 19.68,30.8 11.24,30.8 8.7,33.34 IC3.9
  Bottom 0.406: LED220.C LED204.C LED188.C LED172.C | LED172.C LED156.C LED140.C LED124.C LED108.C LED92.C LED76.C LED60.C | LED60.C LED44.C LED28.C LED12.C | LED172.C 34.17,11.75 | LED60.C v34.17,29.53
N$36  (via drill 0.3)
  Top 0.406: v70.6,20 LED97.A LED98.A | LED98.A v67.42,20 | LED99.A LED98.A | LED99.A v64.25,20 | LED100.A LED99.A | LED100.A v61.08,20 | LED101.A LED100.A | LED101.A v57.9,20 | LED102.A LED101.A | LED102.A v54.73,20 | LED103.A LED102.A | LED103.A v51.55,20 | LED104.A LED103.A | LED104.A v48.38,20 | LED105.A LED104.A | LED105.A v45.2,20 | LED106.A LED105.A | LED106.A v42.02,20 | LED107.A LED106.A | LED107.A v38.85,20 | LED108.A LED107.A | LED108.A v35.67,20 | LED109.A LED108.A | LED109.A v32.5,20 | LED110.A LED109.A | LED110.A v29.32,20 | LED111.A LED110.A | LED111.A v26.15,20 | LED111.A LED112.A v22.98,20
  Bottom 0.406: v67.42,20 LED98.A | v64.25,20 LED99.A | v61.08,20 LED100.A | v57.9,20 LED101.A | v54.73,20 LED102.A | v51.55,20 LED103.A | v48.38,20 LED104.A 49.21,20.95 T7.3 | v45.2,20 LED105.A | v42.02,20 LED106.A | v38.85,20 LED107.A | v35.67,20 LED108.A | v32.5,20 LED109.A | v29.32,20 LED110.A | v26.15,20 LED111.A | v22.98,20 LED112.A | v70.6,20 LED97.A
N$37  (via drill 0.3)
  Top 0.406: v31,32.07 31,31.75 20,31.75 19.68,31.43 11.4,31.43 9.5,33.34 IC3.8
  Bottom 0.406: LED221.C LED205.C LED189.C LED173.C LED157.C LED141.C LED125.C LED109.C LED93.C LED77.C LED61.C LED45.C | LED45.C LED29.C LED13.C | LED45.C v31,32.07
N$39  (via drill 0.3)
  Top 0.406: LED2.A v67.42,35.24 | LED3.A LED2.A | LED3.A v64.25,35.24 | LED4.A LED3.A | LED4.A v61.08,35.24 | LED5.A LED4.A | LED5.A v57.9,35.24 | LED6.A LED5.A | LED6.A v54.73,35.24 | LED7.A LED6.A | LED7.A v51.55,35.24 | LED8.A LED7.A | LED8.A v48.38,35.24 | LED9.A LED8.A | LED9.A v45.2,35.24 | LED10.A LED9.A | LED10.A v42.02,35.24 | LED11.A LED10.A | LED11.A v38.85,35.24 | LED12.A LED11.A | LED12.A v35.67,35.24 | LED13.A LED12.A | LED13.A v32.5,35.24 | LED14.A LED13.A | LED14.A v29.32,35.24 | LED15.A LED14.A | LED15.A v26.15,35.24 | LED15.A LED16.A v22.98,35.24 | LED2.A LED1.A v70.6,35.24
  Bottom 0.406: v61.08,35.24 LED4.A | v57.9,35.24 LED5.A | v54.73,35.24 LED6.A | v51.55,35.24 LED7.A | v48.38,35.24 LED8.A | v45.2,35.24 LED9.A | v42.02,35.24 LED10.A | v38.85,35.24 LED11.A | v35.67,35.24 LED12.A | v32.5,35.24 LED13.A | v29.32,35.24 LED14.A | v26.15,35.24 LED15.A | v22.98,35.24 LED16.A | T1.3 68.26,36.2 LED2.A v67.42,35.24 | 70.48,36.2 LED1.A v70.6,35.24 | v64.25,35.24 LED3.A
N$41  (via drill 0.3)
  Top 0.406: v27.82,34.61 27.82,34.29 21.59,34.29 19.37,32.07 11.57,32.07 10.3,33.34 IC3.7
  Bottom 0.406: LED30.C LED14.C | LED30.C LED46.C LED62.C LED78.C LED94.C LED110.C LED126.C LED142.C | LED142.C LED158.C LED174.C LED190.C LED206.C LED222.C | LED142.C 27.82,16.83 | LED30.C v27.82,34.61
N$42  (via drill 0.3)
  Top 0.406: IC3.6 13.5,35.73 15.24,37.47 24.77,37.47 v25.08,37.15
  Bottom 0.406: LED127.C LED111.C LED95.C LED79.C LED63.C LED47.C LED31.C LED15.C 25.08,36.2 v25.08,37.15 | LED127.C LED143.C LED159.C LED175.C LED191.C LED207.C LED223.C | LED127.C 24.65,19.37
N$43  (via drill 0.3)
  Top 0.406: IC3.5 14.3,35.57 15.56,36.83 19.68,36.83 v20.32,36.2
  Bottom 0.406: LED112.C LED96.C LED80.C LED64.C LED48.C LED32.C LED16.C v20.32,36.2 | LED112.C LED128.C LED144.C LED160.C LED176.C LED192.C LED208.C LED224.C | LED112.C 21.48,21.91
RESET
  Top 0.254: RST.TP 3.81,4.76 5.84,6.79 7.18,6.79 8.26,5.71 11.75,5.71 12.38,5.08 R1.2 12.78,5.08 IC1.29
ROW_FET1  (via drill 0.3)
  Top 0.254: v66.67,37.08 66.67,37.59 61.34,42.93 2.92,42.93 v1.59,41.59
  Bottom 0.254: T1.1 | v1.59,41.59 1.21,41.21 1.21,30.86 3.66,28.41 IC2.16
  Bottom 0.406: T1.1 67.31,37.72 v66.67,37.08
ROW_FET2  (via drill 0.3)
  Top 0.254: v63.5,37.08 63.5,37.59 58.55,42.55 3.81,42.55 v2.54,41.27
  Bottom 0.254: v2.54,41.27 1.59,40.32 1.59,31.43 3.01,30.01 IC2.18
  Bottom 0.406: T2.1 64.14,37.72 v63.5,37.08
ROW_FET3  (via drill 0.3)
  Top 0.254: v60.33,37.08 60.33,37.59 55.75,42.16 4.7,42.16 v3.49,40.96
  Bottom 0.254: v3.49,40.96 1.97,39.43 1.97,32 3.16,30.81 IC2.19
  Bottom 0.406: T3.1 60.96,37.72 v60.33,37.08
ROW_FET4  (via drill 0.3)
  Top 0.254: v57.15,37.08 57.15,37.59 52.96,41.78 5.59,41.78 v4.45,40.64
  Bottom 0.254: v4.45,40.64 2.35,38.54 2.35,32.58 3.31,31.61 IC2.20
  Bottom 0.406: T4.1 57.79,37.72 v57.15,37.08
ROW_FET5  (via drill 0.3)
  Top 0.254: v53.98,37.08 53.98,37.59 50.16,41.4 6.48,41.4 v5.4,40.32
  Bottom 0.254: v5.4,40.32 2.73,37.66 2.73,33.15 3.47,32.41 IC2.21
  Bottom 0.406: T5.1 54.61,37.72 v53.98,37.08
ROW_FET6  (via drill 0.3)
  Top 0.254: v50.8,37.08 50.8,37.59 47.37,41.02 7.37,41.02 v6.35,40.01
  Bottom 0.254: 4.95,33.21 IC2.22 3.62,33.21 3.11,33.72 3.11,36.77 v6.35,40.01
  Bottom 0.406: T6.1 51.44,37.72 v50.8,37.08
ROW_FET7  (via drill 0.3)
  Top 0.254: v47.62,37.08 47.62,37.59 44.58,40.64 8.26,40.64 v7.3,39.69
  Bottom 0.254: v7.3,39.69 6.79,39.18 IC2.23
  Bottom 0.406: T7.1 48.26,37.72 v47.62,37.08
ROW_FET8  (via drill 0.3)
  Top 0.254: v44.45,37.08 44.45,37.59 41.78,40.26 9.14,40.26 v8.26,39.37
  Bottom 0.254: v8.26,39.37 8.26,39.05 9.99,37.31 IC2.27
  Bottom 0.406: T8.1 45.09,37.72 v44.45,37.08
ROW_FET9  (via drill 0.3)
  Top 0.254: v41.27,37.08 41.27,37.59 38.99,39.88 10.03,39.88 v9.21,39.05
  Bottom 0.254: v9.21,39.05 9.21,38.73 10.79,37.15 IC2.28
  Bottom 0.406: T9.1 41.91,37.72 v41.27,37.08
ROW_FET10  (via drill 0.3)
  Top 0.254: v38.1,37.08 38.1,37.59 36.2,39.5 10.92,39.5 v10.16,38.73
  Bottom 0.254: v10.16,38.73 10.16,38.42 11.6,36.98 IC2.29
  Bottom 0.406: T10.1 38.74,37.72 v38.1,37.08
ROW_FET11  (via drill 0.3)
  Top 0.254: v34.92,37.08 34.92,37.59 33.4,39.12 11.81,39.12 v11.11,38.42
  Bottom 0.254: v11.11,38.42 11.11,38.1 12.39,36.82 IC2.30
  Bottom 0.406: T11.1 35.56,37.72 v34.92,37.08
ROW_FET12  (via drill 0.3)
  Top 0.254: v31.75,37.08 31.75,37.59 30.61,38.73 12.7,38.73 v12.06,38.1
  Bottom 0.254: v12.06,38.1 12.06,37.78 13.2,36.65 IC2.31
  Bottom 0.406: T12.1 32.39,37.72 v31.75,37.08
ROW_FET13  (via drill 0.3)
  Top 0.254: v28.57,37.08 28.57,37.59 27.81,38.35 13.59,38.35 v13.02,37.78
  Bottom 0.254: v13.02,37.78 13.02,37.47 13.99,36.49 IC2.32
  Bottom 0.406: T13.1 29.21,37.72 v28.57,37.08
ROW_FET14  (via drill 0.3)
  Top 0.254: v25.91,37.15 25.91,37.34 25.27,37.97 14.48,37.97 v13.97,37.47
  Bottom 0.254: v13.97,37.47 13.97,37.15 14.79,36.32 IC2.33
  Bottom 0.406: T14.1 26.04,37.28 v25.91,37.15
SD_CLK  (via drill 0.3)
  Top 0.254: SCK.TP v6.99,6.03 | v6.29,13.91 IC1.17 15.18,13.91 16,14.73 16,16.13 15.15,16.98 v14.51,16.98
  Bottom 0.254: v6.99,6.03 9.08,8.13 11.94,8.13 14.1,10.29 14.1,11.3 13.34,12.06 7.24,12.06 6.29,13.02 v6.29,13.91 | SLOT1.5 12.02,18.41 13.46,16.98 v14.51,16.98 RN2.1
SD_CMD/DI  (via drill 0.3)
  Top 0.254: v8.72,17.46 9.21,17.46 10.38,16.29 IC1.15 | MOSI.TP 5.4,5.4 v6.03,6.03
  Bottom 0.254: SLOT1.3 9.82,18.56 v8.72,17.46 8.15,16.89 6.25,16.89 | RN1.4 3.33,18.9 5.33,16.89 6.25,16.89 | v6.03,6.03 8.57,8.57 11.75,8.57 13.65,10.48 13.65,11.11 13.21,11.56 7.11,11.56 5.59,13.08 5.59,14.59 6.25,15.25 6.25,16.89
SD_DAT0/DO  (via drill 0.3)
  Top 0.254: v14.22,18.41 13.52,19.11 8.37,19.11 6.99,17.73 v6.99,16.14 6.99,16.51 9.21,16.51 9.58,16.14 IC1.16 | MISO.TP v11.43,4.13
  Bottom 0.254: SLOT1.7 v14.22,18.41 15.11,17.53 RN2.2 | v11.43,4.13 11.43,6.99 14.54,10.1 14.54,11.56 13.53,12.57 7.37,12.57 6.99,12.95 v6.99,16.14
SD_DAT1
  Bottom 0.254: SLOT1.8 15.32,18.41 15.71,18.03 RN2.3
SD_DAT2
  Bottom 0.254: SLOT1.1 7.62,18.41 6.86,17.65 5.84,17.65 4.38,19.12 RN1.2
SD_DAT3/CS  (via drill 0.3)
  Top 0.254: v8.72,18.41 9.21,18.41 11.18,16.44 IC1.14
  Bottom 0.254: SLOT1.2 v8.72,18.41 7.58,17.27 5.59,17.27 3.88,18.98 RN1.3
SD_DETECT  (via drill 0.3)
  Top 0.254: v5.08,15.24 v7.75,15.24 | T15.1 3.74,11.68 v4.66,12.6
  Bottom 0.254: v5.08,15.24 5.08,13.02 v4.66,12.6 | v7.75,15.24 15.24,15.24 16.5,16.5 17.75,16.5 18.25,16 18.25,9.5 17.9,9.15 SLOT1.11
STATUS_LED1  (via drill 0.3)
  Top 0.254: IC1.23 6.89,9.11 v5.71,7.94
  Bottom 0.254: RN4.5 4.61,6.83 v5.71,7.94
STATUS_LED2  (via drill 0.3)
  Top 0.254: IC1.24 7.04,8.31 v6.67,7.94
  Bottom 0.254: RN4.8 0.79,6.39 1.02,6.16 4.89,6.16 v6.67,7.94
TCK  (via drill 0.3)
  Top 0.254: v4.13,23.75 4.32,23.94 4.32,33.72 3.43,34.61 TCK.TP 2.2,34.6 1.5,33.9 1.5,30.5 2.09,29.91 RN3.2
  Bottom 0.254: IC2.11 6.79,24.32 6.67,24.45 6.35,24.45 5.97,24.07 4.45,24.07 v4.13,23.75
TDI  (via drill 0.3)
  Top 0.254: v4.95,23.3 4.83,23.43 4.83,36.58 3.62,37.78 TDI.TP 2.78,37.8 2.2,37.8 0.7,36.3 0.7,30.1 1.04,29.76 RN3.4
  Bottom 0.254: IC2.9 8.39,22.05 8.19,21.84 6.42,21.84 v4.95,23.3
TDO  (via drill 0.3)
  Top 0.254: v5.71,38.1 v7.62,38.1 | v3.81,36.2 TDO.TP 2.2,36.2 1.1,35.1 1.1,30.3 1.59,29.81 RN3.3
  Bottom 0.254: IC2.24 7.62,35.23 v7.62,38.1 | v3.81,36.2 v5.71,38.1
TMS  (via drill 0.3)
  Top 0.254: v3.37,24.26 3.81,24.7 3.81,32.64 3.43,33.02 TMS.TP 2.77,33 2.2,33 1.9,32.7 1.9,30.7 2.64,29.96 RN3.1
  Bottom 0.254: IC2.10 7.59,24.28 6.99,24.89 6.16,24.89 5.78,24.51 3.62,24.51 v3.37,24.26
VCC1  (via drill 0.3)
  Top 0.406: L1.1 5.34,20.32 v6.22,21.2
  Bottom 0.254: RN2.7 RN2.6 RN2.5 19.52,19.79 C5.1 | RN1.5 RN1.6 RN1.7 RN1.8 5.37,22.07 v6.22,21.2
  Bottom 0.406: 10.92,21.2 17.21,21.2 18.63,19.79 C5.1 | 10.92,21.2 SLOT1.4 | v6.22,21.2 10.92,21.2

## Text on the board
tPlace: (C)2011 CITERA | MINTIA Electric Bulletin Board Rev A | 5V | Designed by Taguchi
bPlace: http://www.citera.info/